# Altium schematic sheet SWD.SchDoc
size A
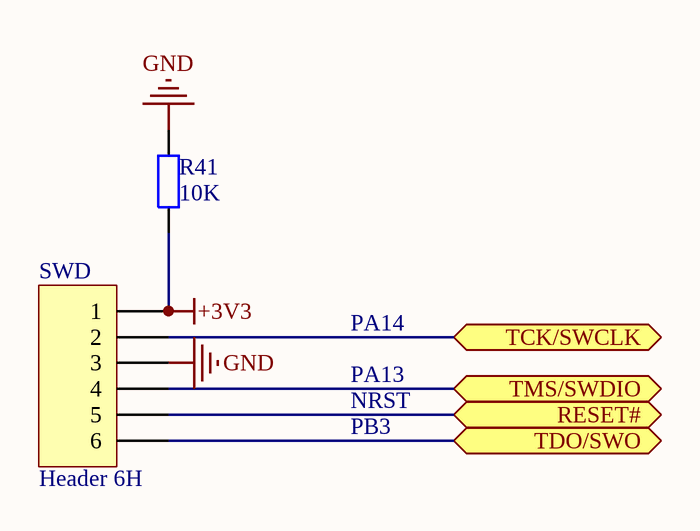
[diagram p0: SWD.SchDoc]

## Parts
R41  value 10K  [0603_R]  (hidden comment: R0.4W)
SWD  Header 6H  [HDR1X6]

## Ports
RESET#, TCK/SWCLK, TDO/SWO, TMS/SWDIO

## Nets
+3V3: R41.2 SWD.1
GND: R41.1 SWD.3
RESET#: SWD.5 ; port RESET#
TCK/SWCLK: SWD.2 ; port TCK/SWCLK
TDO/SWO: SWD.6 ; port TDO/SWO
TMS/SWDIO: SWD.4 ; port TMS/SWDIO

## Notes on the sheet
- PA14
- PA13
- NRST
- PB3

## Library data of the parts
R41 = Res 1/4 W: Resistor; Published: 8-Jun-2000; LatestRevisionDate: 17-Jul-2002; LatestRevisionNote: Re-released for DXP Platform.; PackageReference: AXIAL-0.4; Publisher: Altium Limited
SWD = Header 6H: Header, 6-Pin, Right Angle; LatestRevisionDate: 17-Jul-2002; LatestRevisionNote: Re-released for DXP Platform.; Publisher: Altium Limited